# EAGLE design final (EAGLE 8.1.0)

## Sheet 1 of 2
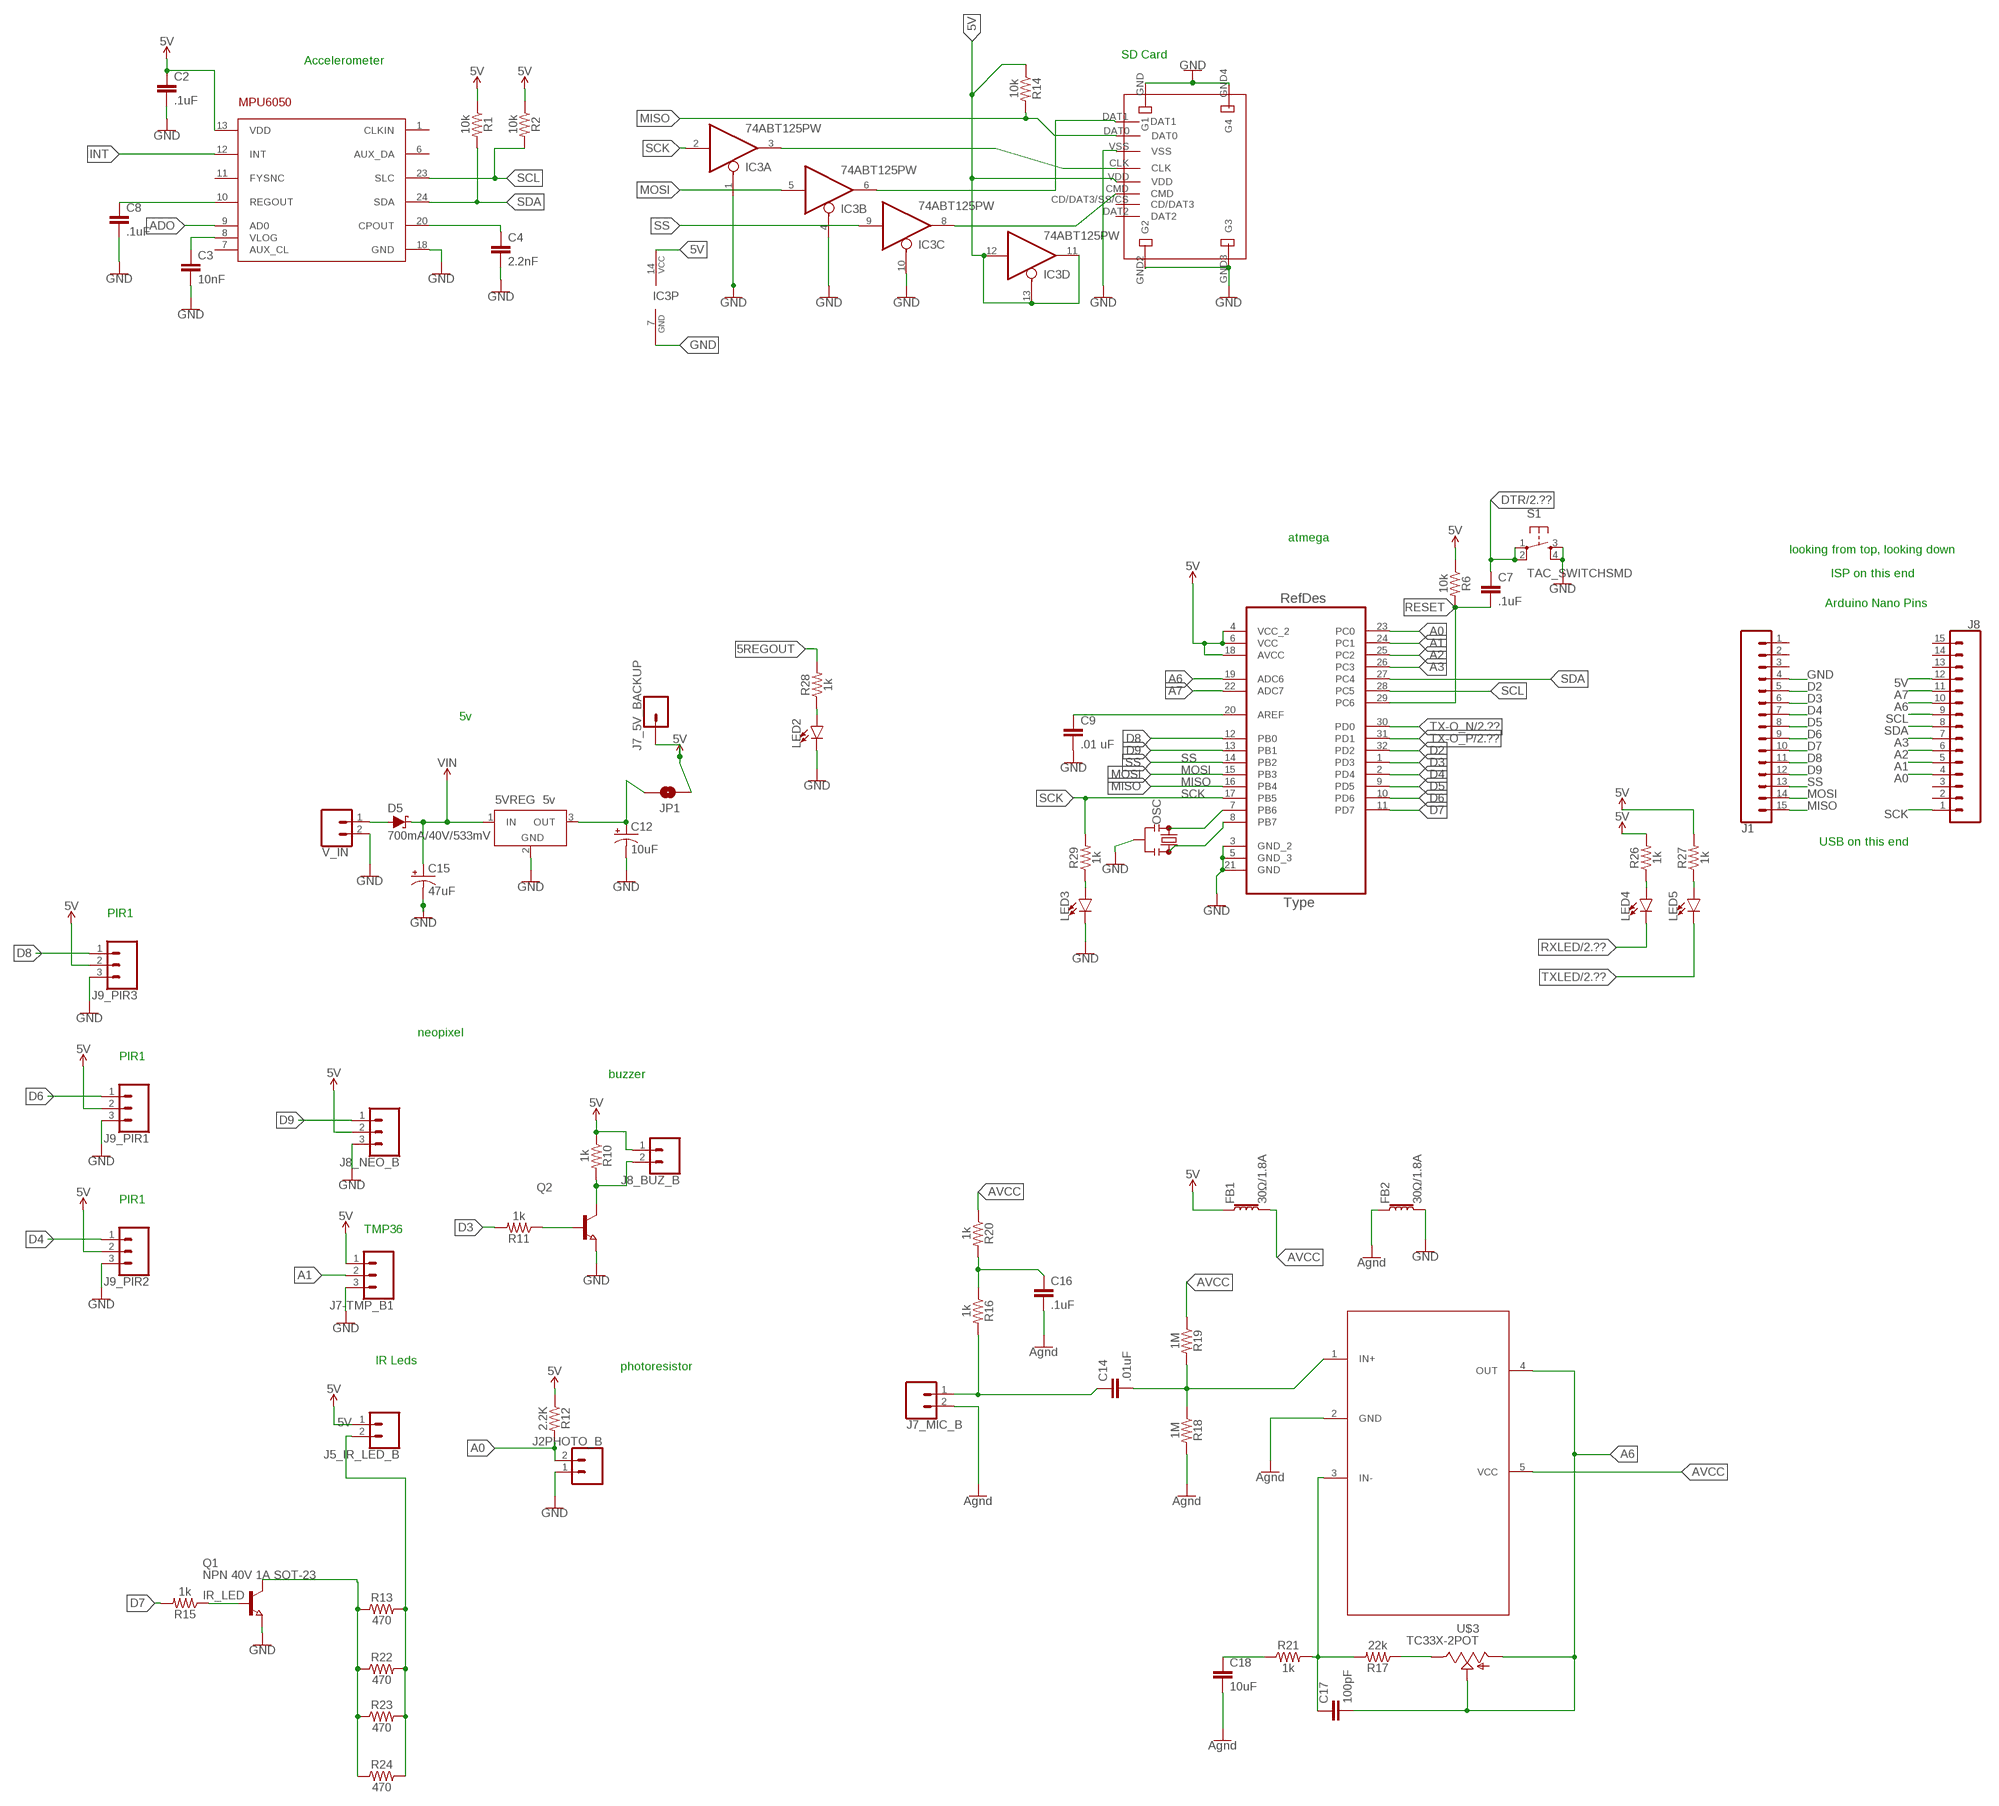
[diagram p0: schematic, sheet 1]

### Parts
5VREG  5v  LT1129CST5  [SOT223]
ATMEGA328P-AU  ATMEGA328P-AU  [QFP80P900X900X120-32N]
C2  .1uF  .22UF-CER  [0402-CAP]
C3  10nF  .22UF-CER  [0402-CAP]
C4  2.2nF  .22UF-CER  [0402-CAP]
C7  .1uF  .22UF-CER  [0402-CAP]
C8  .1uF  .22UF-CER  [0402-CAP]
C9  .01 uF  .22UF-CER  [0402-CAP]
C12  10uF  10UF-TANT  [EIA3216]
C14  .01uF  .22UF-CER  [0402-CAP]
C15  47uF  10UF-TANT  [EIA3216]
C16  .1uF  .22UF-CER  [0402-CAP]
C17  100pF  .22UF-CER  [0402-CAP]
C18  10uF  .22UF-CER  [0402-CAP]
D5  700mA/40V/533mV  DIODE-SCHOTTKY-ZLLS500  [SOT23-3]
FB1  30Ω/1.8A  FERRITE_BEAD-0603  [0603]
FB2  30Ω/1.8A  FERRITE_BEAD-0603  [0603]
IC3  74ABT125PW  [TSSOP14]
IC4  MAX4466KS  [SC70-5]
J1  CONN_15  [1X15]
J2PHOTO_B  CONN_02LOCK  [1X02_LOCK]
J5_IR_LED_B  CONN_02LOCK  [1X02_LOCK]
J7-TMP_B1  CONN_03  [1X03]
J7_5V_BACKUP  CONN_01  [1X01]
J7_MIC_B  CONN_02LOCK  [1X02_LOCK]
J8  CONN_15  [1X15]
J8_BUZ_B  CONN_02LOCK  [1X02_LOCK]
J8_NEO_B  CONN_03  [1X03]
J9_PIR1  CONN_03  [1X03]
J9_PIR2  CONN_03  [1X03]
J9_PIR3  CONN_03  [1X03]
JP1  JUMPER-SMT_2_NO_NO-SILK_ROUND  [SMT-JUMPER_2_NO_NO-SILK_ROUND]
LED2  LED0603  [LED-0603]
LED3  LED0603  [LED-0603]
LED4  LED0603  [LED-0603]
LED5  LED0603  [LED-0603]
MPU6050  MPU-6050  [QFN24-4X4]
OSC  RESONATORSMD-3.2X1.3  [RESONATOR-SMD-3.2X1.3]
Q1  NPN 40V 1A SOT-23  NPN-TRANSISTOR_SOT23  [SOT23]
Q2  NPN-TRANSISTOR_SOT23  [SOT23]
R1  10k  0.05OHM-0603-1/5W-1%  [0603]
R2  10k  0.05OHM-0603-1/5W-1%  [0603]
R6  10k  0.05OHM-0603-1/5W-1%  [0603]
R10  1k  0.05OHM-0603-1/5W-1%  [0603]
R11  1k  0.05OHM-0603-1/5W-1%  [0603]
R12  2.2K  0.05OHM-0603-1/5W-1%  [0603]
R13  470  2.2MOHM-1/10W-5%(0603)  [0603]
R14  10k  0.05OHM-0603-1/5W-1%  [0603]
R15  1k  0.05OHM-0603-1/5W-1%  [0603]
R16  1k  0.05OHM-0603-1/5W-1%  [0603]
R17  22k  0.05OHM-0603-1/5W-1%  [0603]
R18  1M  0.05OHM-0603-1/5W-1%  [0603]
R19  1M  0.05OHM-0603-1/5W-1%  [0603]
R20  1k  0.05OHM-0603-1/5W-1%  [0603]
R21  1k  0.05OHM-0603-1/5W-1%  [0603]
R22  470  2.2MOHM-1/10W-5%(0603)  [0603]
R23  470  2.2MOHM-1/10W-5%(0603)  [0603]
R24  470  2.2MOHM-1/10W-5%(0603)  [0603]
R26  1k  2.2MOHM-1/10W-5%(0603)  [0603]
R27  1k  2.2MOHM-1/10W-5%(0603)  [0603]
R28  1k  2.2MOHM-1/10W-5%(0603)  [0603]
R29  1k  2.2MOHM-1/10W-5%(0603)  [0603]
S1  TAC_SWITCHSMD  [TACTILE-SWITCH-SMD]
U$2  WM6698TR-ND_MICROSD  [MICROSD2]
U$3  TC33X-2POT  [TC33X-2]
V_IN  CONN_02LOCK  [1X02_LOCK]

### Nets
2.2NF: C4.1 MPU6050.20(CPOUT)
5REGOUT: 5VREG.3(OUT) C12.A(+) JP1.2 R28.2
5V: ATMEGA328P-AU.4(VCC_2) ATMEGA328P-AU.6(VCC) ATMEGA328P-AU.18(AVCC) C2.1 FB1.1 IC3.11(D:O) IC3.12(D:I) IC3.13(D:OE) IC3.14(P:VCC) J5_IR_LED_B.1 J7-TMP_B1.1 J7_5V_BACKUP.1 J8.12 J8_BUZ_B.1 J8_NEO_B.2 J9_PIR1.2 J9_PIR2.2 J9_PIR3.2 JP1.1 MPU6050.13(VDD) R1.1 R2.1 R6.1 R10.1 R12.1 R14.1 R26.2 R27.2 U$2.VDD ; also sheet 2
10NF: C3.1 MPU6050.8(VLOG)
.UF: C8.1 MPU6050.10(REGOUT)
A0: ATMEGA328P-AU.23(PC0) J2PHOTO_B.2 J8.4 R12.2
A1: ATMEGA328P-AU.24(PC1) J7-TMP_B1.2 J8.5
A2: ATMEGA328P-AU.25(PC2) J8.6
A3: ATMEGA328P-AU.26(PC3) J8.7
A6: ATMEGA328P-AU.19(ADC6) C17.2 IC4.4(OUT) J8.10 U$3.2 U$3.3
A7: ATMEGA328P-AU.22(ADC7) J8.11
ADO: MPU6050.9(AD0)
AVCC: FB1.2 IC4.5(VCC) R19.1 R20.1
BUZ-: J8_BUZ_B.2 Q2.3(C) R10.2
D2: ATMEGA328P-AU.32(PD2) J1.5
D3: ATMEGA328P-AU.1(PD3) J1.6 R11.2
D4: ATMEGA328P-AU.2(PD4) J1.7 J9_PIR2.1
D5: ATMEGA328P-AU.9(PD5) J1.8
D6: ATMEGA328P-AU.10(PD6) J1.9 J9_PIR1.1
D7: ATMEGA328P-AU.11(PD7) J1.10 R15.2
D8: ATMEGA328P-AU.12(PB0) J1.11 J9_PIR3.1
D9: ATMEGA328P-AU.13(PB1) J1.12 J8_NEO_B.1
DAT1: IC3.6(B:O) U$2.DAT1
DTR: C7.1 S1.1 S1.2 ; also sheet 2
GND: 5VREG.2(GND) ATMEGA328P-AU.3(GND_2) ATMEGA328P-AU.5(GND_3) ATMEGA328P-AU.21(GND) C2.2 C3.2 C4.2 C8.2 C9.2 C12.C(-) C15.C(-) C16.2 C18.2 FB2.1 FB2.2 IC3.1(A:OE) IC3.4(B:OE) IC3.7(P:GND) IC3.10(C:OE) IC4.2(GND) J1.4 J2PHOTO_B.1 J7-TMP_B1.3 J7_MIC_B.2 J8_NEO_B.3 J9_PIR1.3 J9_PIR2.3 J9_PIR3.3 LED2.C LED3.C MPU6050.18(GND) OSC.2 Q1.2(E) Q2.2(E) R18.2 S1.3 S1.4 U$2.GND2(G2) U$2.GND3(G3) U$2.GND4(G4) U$2.GND(G1) U$2.VSS V_IN.2 ; supply symbol labelled Agnd ; also sheet 2
INT: MPU6050.12(INT)
IR_LED: Q1.1(B) R15.1
LED4: LED4.A R26.1
LED5: LED5.A R27.1
MIC_IN+: C14.2 IC4.1(IN+) R18.1 R19.2
MIC_IN_C14: C14.1 J7_MIC_B.1 R16.2
MICNET1K: C16.1 R16.1 R20.2
MISO: ATMEGA328P-AU.16(PB4) J1.15 R14.2 U$2.DAT0
MOSI: ATMEGA328P-AU.15(PB3) IC3.5(B:I) J1.14
N$1: J5_IR_LED_B.2 R13.2 R22.2 R23.2 R24.2
N$2: Q1.3(C) R13.1 R22.1 R23.1 R24.1
N$4: LED3.A R29.1
N$6: ATMEGA328P-AU.20(AREF) C9.1
N$12: R17.1 U$3.1
N$20: Q2.1(B) R11.1
N$22: D5.1(A) V_IN.1
N$29: C18.1 R21.1
N$30: C17.1 IC4.3(IN-) R17.2 R21.2
PB6: ATMEGA328P-AU.7(PB6) OSC.1
PB7: ATMEGA328P-AU.8(PB7) OSC.3
POWERLED: LED2.A R28.1
RESET: ATMEGA328P-AU.29(PC6) C7.2 R6.2
RXLED: LED4.C ; also sheet 2
SCK: ATMEGA328P-AU.17(PB5) IC3.2(A:I) J8.1 R29.2
SCK_BUFF: IC3.3(A:O) U$2.CLK
SCL: ATMEGA328P-AU.28(PC5) J8.9 MPU6050.23(SLC) R2.2
SDA: ATMEGA328P-AU.27(PC4) J8.8 MPU6050.24(SDA) R1.2
SS: ATMEGA328P-AU.14(PB2) IC3.9(C:I) J1.13
SS_BUFF: IC3.8(C:O) U$2.CMD
TX-O_N: ATMEGA328P-AU.30(PD0) ; also sheet 2
TX-O_P: ATMEGA328P-AU.31(PD1) ; also sheet 2
TXLED: LED5.C ; also sheet 2
VIN: 5VREG.1(IN) C15.A(+) D5.3(C)
Unconnected: J1.1 J1.2 J1.3 J8.2 J8.3 J8.13 J8.14 J8.15 MPU6050.1(CLKIN) MPU6050.6(AUX_DA) MPU6050.7(AUX_CL) MPU6050.11(FYSNC) U$2.CD/DAT3/SS/CS(CD/DAT3) U$2.DAT2

### Notes on the sheet
- SD Card
- Accelerometer
- atmega
- looking from top, looking down
- ISP on this end
- Arduino Nano Pins
- 5v
- USB on this end
- PIR1
- neopixel
- PIR1
- buzzer
- PIR1
- TMP36
- IR Leds
- photoresistor

## Sheet 2 of 2
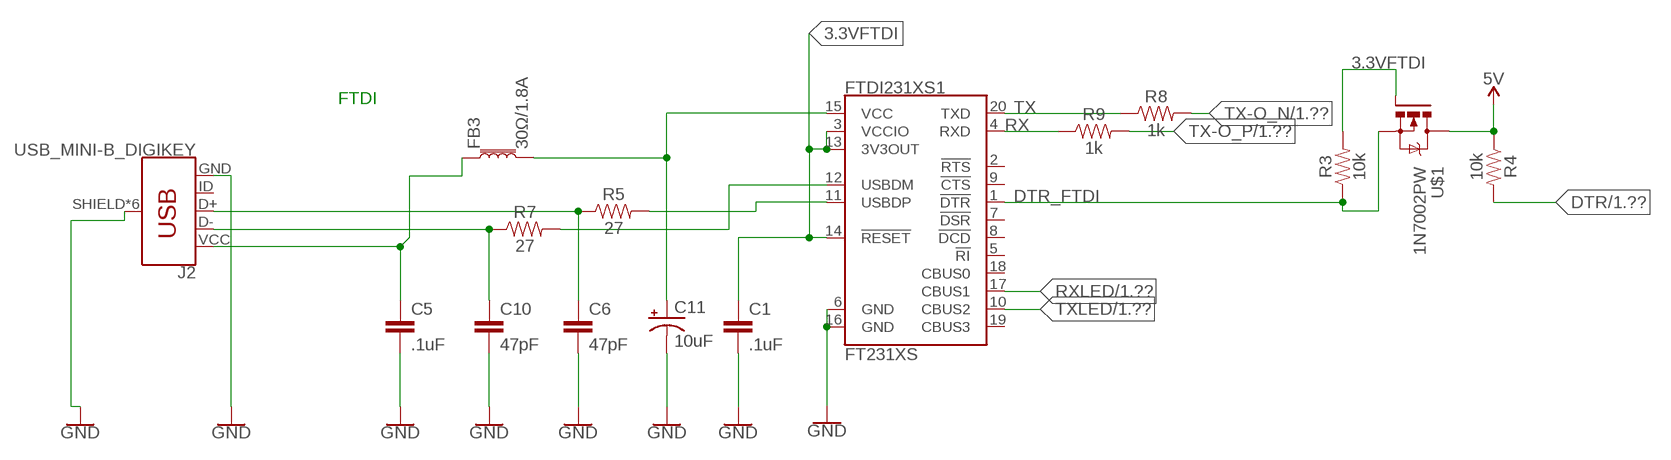
[diagram p1: schematic, sheet 2]

### Parts
C1  .1uF  .22UF-CER  [0402-CAP]
C5  .1uF  .22UF-CER  [0402-CAP]
C6  47pF  .22UF-CER  [0402-CAP]
C10  47pF  .22UF-CER  [0402-CAP]
C11  10uF  10UF-TANT  [EIA3216]
FB3  30Ω/1.8A  FERRITE_BEAD-0603  [0603]
FTDI231XS1  FT231XS  [SSOP20_L]
J2  USB_MINI-B_DIGIKEY  [MICRO-USB-DIGIKEY-FCI2]
R3  10k  0.05OHM-0603-1/5W-1%  [0603]
R4  10k  0.05OHM-0603-1/5W-1%  [0603]
R5  27  0.05OHM-0603-1/5W-1%  [0603]
R7  27  0.05OHM-0603-1/5W-1%  [0603]
R8  1k  0.05OHM-0603-1/5W-1%  [0603]
R9  1k  0.05OHM-0603-1/5W-1%  [0603]
U$1  1N7002PW  [SOT323W_INFINEON]

### Nets
3.3VFTDI: C1.1 FTDI231XS1.3(VCCIO) FTDI231XS1.13(3V3OUT) FTDI231XS1.14(!RESET) R3.2 U$1.1(G)
5V: R4.1 U$1.3(D) ; also sheet 1
DN_N: C10.1 J2.D- R7.1
DN_P: C6.1 J2.D+ R5.1
DTR: R4.2 ; also sheet 1
DTR_FTDI: FTDI231XS1.1(!DTR) R3.1 U$1.2(S)
GND: C1.2 C5.2 C6.2 C10.2 C11.C(-) FTDI231XS1.6(GND) FTDI231XS1.16(GND) J2.GND J2.SHIELD J2.SHIELD1(SHIELD) J2.SHIELD2(SHIELD) J2.SHIELD3(SHIELD) J2.SHIELD4(SHIELD) J2.SHIELD5(SHIELD) ; also sheet 1
RX: FTDI231XS1.4(RXD) R9.1
RXLED: FTDI231XS1.17(CBUS1) ; also sheet 1
TX: FTDI231XS1.20(TXD) R8.1
TX-O_N: R8.2 ; also sheet 1
TX-O_P: R9.2 ; also sheet 1
TXLED: FTDI231XS1.10(CBUS2) ; also sheet 1
USBD_N: FTDI231XS1.12(USBDM) R7.2
USBD_P: FTDI231XS1.11(USBDP) R5.2
VUSB: C5.1 C11.A(+) FB3.1 FB3.2 FTDI231XS1.15(VCC) J2.VCC(VBUS)
Unconnected: FTDI231XS1.2(!RTS) FTDI231XS1.5(!RI) FTDI231XS1.7(!DSR) FTDI231XS1.8(!DCD) FTDI231XS1.9(!CTS) FTDI231XS1.18(CBUS0) FTDI231XS1.19(CBUS3) J2.ID

### Notes on the sheet
- FTDI

## Power pins joined to a net without a drawn wire
GND: 5VREG.4(GND)

## Library data of the parts
5VREG = linear-technology:LT1129CST5: VOLTAGE REGULATOR with shutdown; MPN: LT1129CST-5#PBF; OC_FARNELL: 1663375; OC_NEWARK: 57M2069
ATMEGA328P-AU = Atmega-328pu:ATMEGA328P-AU; DESCRIPTION: 8-bit Microcontroller with In-System Programmable Flash; MPN: ATMEGA328P-AU; OC_FARNELL: 1715486; OC_NEWARK: 14R4631; PACKAGE: TQFP-32; SUPPLIER: Atmel
C1-C10 C14 C16-C18 = SparkFun-Retired:.22UF-CER: .22uF ceramic SMT CAP-09885- 50V +80%/-20% (0603); PROD_ID: CAP-09885; VALUE: .22uF
C11 C12 = SparkFun-Retired:10UF-TANT: 10uF Tantalum SMT CAP-00811- 16V 10% (EIA-3216); PROD_ID: CAP-00811
C15 = SparkFun-Retired:10UF-TANT: 10uF Tantalum SMT CAP-00811- 16V 10% (EIA-3216); PROD_ID: CAP-00811; VALUE: 10uF
D5 = SparkFun-DiscreteSemi:DIODE-SCHOTTKY: Schottky diode A Schottky diode is a semiconductor diode which has a low forward voltage drop and a very fast switching action.; PROD_ID: DIO-08411
FB1-FB3 = SparkFun-Coils:FERRITE_BEAD: Ferrite Bead (blocks, cores, rings, chokes, etc.) Inductor with layers of ferrite used to suppress high frequencies. Often used to isolate high frequency noise. SparkFun Products: IOIO-OTG - V2.2 <https://www.sparkfun.com/products/13613> SparkFun SAMD21 Mini Breakout <https://www.sparkfun.com/products/13664> SparkFun 6 Degrees of Freedom Breakout - LSM6DS3 <https://www.sparkfun.com/products/13339> SparkFun SAMD21 Dev Breakout <https://www.sparkfun.com/products/13672>; PROD_ID: NDUC-07859
FTDI231XS1 = SparkFun-IC-Comms:FT231X: FTDI FT231X Full Speed USB to Full-handshake UART This USB2.0 Full Speed IC offers a compact bridge to full handshake UART interfaces. The device is a UART, capable of operating up to 3MBaud, with low power consumption (8mA). The FT231X includes the complete FT-X series feature set and enables USB to be added into a system design quickly and easily over a UART interface. Datasheet <http://cdn.sparkfun.com/datasheets/Components/General%20IC/DS_FT231X.pdf> SparkFun Products SparkFun RedBoard - Programmed with Arduino <https://www.sparkfun.com/products/12757> (DEV-12757) SparkFun XBee Explorer USB <https://www.sparkfun.com/products/11812> (WRL-11812) SparkFun XBee Explorer Dongle <https://www.sparkfun.com/products/11697> (WRL-11697) SparkFun Blynk Board - ESP8266 <https://www.sparkfun.com/products/13794> (WRL-13794) SparkFun ESP8266 Thing - Dev Board <https://www.sparkfun.com/products/13711> (WRL-13711) SparkFun Block for Intel® Edison - Base <https://www.sparkfun.com/products/13045> (DEV-13045) SparkFun RedStick <https://www.sparkfun.com/products/13741> (DEV-13741) SparkFun Beefy 3 - FTDI Basic Breakout <https://www.sparkfun.com/products/13746> (DEV-13746) SparkFun FT231X Breakout <https://www.sparkfun.com/products/11736> (BOB-11736); PROD_ID: IC-11524
IC3 = 74xx-us:74*125: Quad bus BUFFER, 3-state
IC4 = KevinKuwata1:MAX4466: MAX4466 SOT23 SC70 mic amp arduino adafruit sparkfun
J1 J8 = SparkFun-Connectors:CONN_15: Multi connection point. Often used as Generic Header-pin footprint for 0.1 inch spaced/style header connections On any of the 0.1 inch spaced packages, you can populate with these: Break Away Headers - Straight <https://www.sparkfun.com/products/116> (PRT-00116) Break Away Male Headers - Right Angle <https://www.sparkfun.com/products/553> (PRT-00553) Female Headers <https://www.sparkfun.com/products/115> (PRT-00115) Break Away Headers - Machine Pin <https://www.sparkfun.com/products/117> (PRT-00117) Break Away Female Headers - Swiss Machine Pin <https://www.sparkfun.com/products/743> (PRT-00743) For SCREWTERMINALS and SPRING TERMINALS visit here: Screw Terimnals on SparkFun.com <https://www.sparkfun.com/search/results?term=Screw+Terminals> (5mm/3.5mm/2.54mm spacing) This device is also useful as a general connection point to wire up your design to another part of your project. Our various solder wires solder well into these plated through hole pads. Hook-Up Wire - Assortment (Stranded, 22 AWG) <https://www.sparkfun.com/products/11375> (PRT-11375) Hook-Up Wire - Assortment (Solid Core, 22 AWG) <https://www.sparkfun.com/products/11367> (PRT-11367) View the entire wire category on our website here <https://www.sparkfun.com/categories/141> Special notes: Molex polarized connector foot print use with SKU : PRT-08231 with associated crimp pins and housings. 1MM SMD Version SKU: PRT-10208 NOTES ON THE VARIANTS LOCK and LOCK_LONGPADS... This footprint was designed to help hold the alignment of a through-hole component (i.e. 6-pin header) while soldering it into place. You may notice that each hole has been shifted either up or down by 0.005 of an inch from it's more standard position (which is a perfectly straight line). This slight alteration caused the pins (the squares in the middle) to touch the edges of the holes. Because they are alternating, it causes a "brace" to hold the component in place. 0.005 has proven to be the perfect amount of "off-center" position when using our standard breakaway headers. Although looks a little odd when you look at the bare footprint, once you have a header in there, the alteration is very hard to notice. Also,if you push a header all the way into place, it is covered up entirely on the bottom side.
J2 = KevinKuwata1:USB_MINI-B_DIGIKEY: USB type Mini-B Connector Breaks out 5th pin, and includes shield pins if needed. SparkFun Products: SparkFun FTDI Basic Breakout <https://www.sparkfun.com/products/9716> SparkFun XBee Explorer USB <https://www.sparkfun.com/products/11812> SparkFun Redboard <https://www.sparkfun.com/products/12757>
J2PHOTO_B J5_IR_LED_B J7_MIC_B J8_BUZ_B V_IN = SparkFun-Connectors:CONN_02: Multi connection point. Often used as Generic Header-pin footprint for 0.1 inch spaced/style header connections On any of the 0.1 inch spaced packages, you can populate with these: Break Away Headers - Straight <https://www.sparkfun.com/products/116> (PRT-00116) Break Away Male Headers - Right Angle <https://www.sparkfun.com/products/553> (PRT-00553) Female Headers <https://www.sparkfun.com/products/115> (PRT-00115) Break Away Headers - Machine Pin <https://www.sparkfun.com/products/117> (PRT-00117) Break Away Female Headers - Swiss Machine Pin <https://www.sparkfun.com/products/743> (PRT-00743) For SCREWTERMINALS and SPRING TERMINALS visit here: Screw Terimnals on SparkFun.com <https://www.sparkfun.com/search/results?term=Screw+Terminals> (5mm/3.5mm/2.54mm spacing) This device is also useful as a general connection point to wire up your design to another part of your project. Our various solder wires solder well into these plated through hole pads. Hook-Up Wire - Assortment (Stranded, 22 AWG) <https://www.sparkfun.com/products/11375> (PRT-11375) Hook-Up Wire - Assortment (Solid Core, 22 AWG) <https://www.sparkfun.com/products/11367> (PRT-11367) View the entire wire category on our website here <https://www.sparkfun.com/categories/141> Special notes: Molex polarized connector foot print use with: PRT-08233 with associated crimp pins and housings. 2.54_SCREWTERM for use with PRT-10571. 3.5mm Screw Terminal footprints for PRT-08084 5mm Screw Terminal footprints for use with PRT-08432
J7-TMP_B1 J8_NEO_B J9_PIR1-J9_PIR3 = SparkFun-Connectors:CONN_03: Multi connection point. Often used as Generic Header-pin footprint for 0.1 inch spaced/style header connections On any of the 0.1 inch spaced packages, you can populate with these: Break Away Headers - Straight <https://www.sparkfun.com/products/116> (PRT-00116) Break Away Male Headers - Right Angle <https://www.sparkfun.com/products/553> (PRT-00553) Female Headers <https://www.sparkfun.com/products/115> (PRT-00115) Break Away Headers - Machine Pin <https://www.sparkfun.com/products/117> (PRT-00117) Break Away Female Headers - Swiss Machine Pin <https://www.sparkfun.com/products/743> (PRT-00743) Stackable Header - 3 Pin (Female, 0.1") <https://www.sparkfun.com/products/13875> (PRT-13875) For SCREWTERMINALS and SPRING TERMINALS visit here: Screw Terimnals on SparkFun.com <https://www.sparkfun.com/search/results?term=Screw+Terminals> (5mm/3.5mm/2.54mm spacing) This device is also useful as a general connection point to wire up your design to another part of your project. Our various solder wires solder well into these plated through hole pads. Hook-Up Wire - Assortment (Stranded, 22 AWG) <https://www.sparkfun.com/products/11375> (PRT-11375) Hook-Up Wire - Assortment (Solid Core, 22 AWG) <https://www.sparkfun.com/products/11367> (PRT-11367) View the entire wire category on our website here <https://www.sparkfun.com/categories/141> Special notes: Molex polarized connector foot print use with SKU : PRT-08232 with associated crimp pins and housings.
J7_5V_BACKUP = SparkFun-Connectors:CONN_01: Single connection point. Often used as Generic Header-pin footprint for 0.1 inch spaced/style header connections On any of the 0.1 inch spaced packages, you can populate with these: Break Away Headers - Straight <https://www.sparkfun.com/products/116> (PRT-00116) Break Away Male Headers - Right Angle <https://www.sparkfun.com/products/553> (PRT-00553) Female Headers <https://www.sparkfun.com/products/115> (PRT-00115) Break Away Headers - Machine Pin <https://www.sparkfun.com/products/117> (PRT-00117) Break Away Female Headers - Swiss Machine Pin <https://www.sparkfun.com/products/743> (PRT-00743) This device is also useful as a general connection point to wire up your design to another part of your project. Our various solder wires solder well into these plated through hole pads. Hook-Up Wire - Assortment (Stranded, 22 AWG) <https://www.sparkfun.com/products/11375> (PRT-11375) Hook-Up Wire - Assortment (Solid Core, 22 AWG) <https://www.sparkfun.com/products/11367> (PRT-11367) View the entire wire category on our website here <https://www.sparkfun.com/categories/141> Special notes: SMTSO-256-ET is a "flush mount" nut for a 4-40 screw. We mostly use this on specialty testbeds; it is a nice way to connect hardware to your PCB at an adjustable hieght. Also note, the SNAP packages are for using a snappable style connector. We sell a baggie of snaps and they are also used on two LilyPad designs: Snap Assortment - 30 pack (male and female) <https://www.sparkfun.com/products/11347> (DEV-11347) LilyPad Arduino SimpleSnap <https://www.sparkfun.com/products/10941> (DEV-10941) LilyPad SimpleSnap Protoboard <https://www.sparkfun.com/products/10940> (DEV-10940)
JP1 = SparkFun-Jumpers:JUMPER-SMT_2_NO: Normally open jumper This jumper has two pads in close proximity to each other. Apply solder to close the connection. Round pads are easier to solder for beginners, but are a lot larger. SparkFun Product that uses the round pads: SparkFun EL Sequencer <https://www.sparkfun.com/products/12781>
LED2-LED5 = SparkFun-LED:LED: LED (Generic) Standard schematic elements and footprints for 5mm, 3mm, 1206, and 0603 sized LEDs. Generic LEDs with no color specified.
MPU6050 = KevinKuwata1:MPU-6050
OSC = SparkFun-Clocks:RESONATOR: Resonators (Generic) Ceramic resonators are clock-generating components, often used to control timing in microcontrollers. They usually have 3 pins: two pins for oscillation, and one pin for ground. Compared to crystals, resonators have worse tolerance, but are usually much cheaper. Plus, they have built-in load capacitors! These devices are used on boards like the Arduino Pro 8MHz <https://www.sparkfun.com/products/11114> and Arduino Pro 16MHz <https://www.sparkfun.com/products/11113>.
Q1 Q2 = semicon-smd-ipc:NPN-TRANSISTOR_: NPN TRANSISTOR
R1-R12 R14-R21 = SparkFun-Resistors:0.05OHM: 0.05Ω resistor A resistor is a passive two-terminal electrical component that implements electrical resistance as a circuit element. Resistors act to reduce current flow, and, at the same time, act to lower voltage levels within circuits. - Wikipedia; PROD_ID: RES-12535; VALUE: 0.05
R13 R22-R24 R26-R29 = SparkFun-Retired:2.2MOHM-1/10W-5%(0603): RES-09288; PROD_ID: RES-09288
S1 = SparkFun-Retired:TAC_SWITCH: Momentary Switch Button commonly used for reset or general input. Spark Fun Electronics SKU : COM-00097 SMT- SWCH-08247; PROD_ID: SWCH-08247
U$1 = KevinKuwata1:1N7002PW
U$2 = KevinKuwata1:WM6698TR-ND_MICROSD
U$3 = KevinKuwata1:TC33X-2POT

## Net classes
0 default: clearance 0.051 mm

## Board
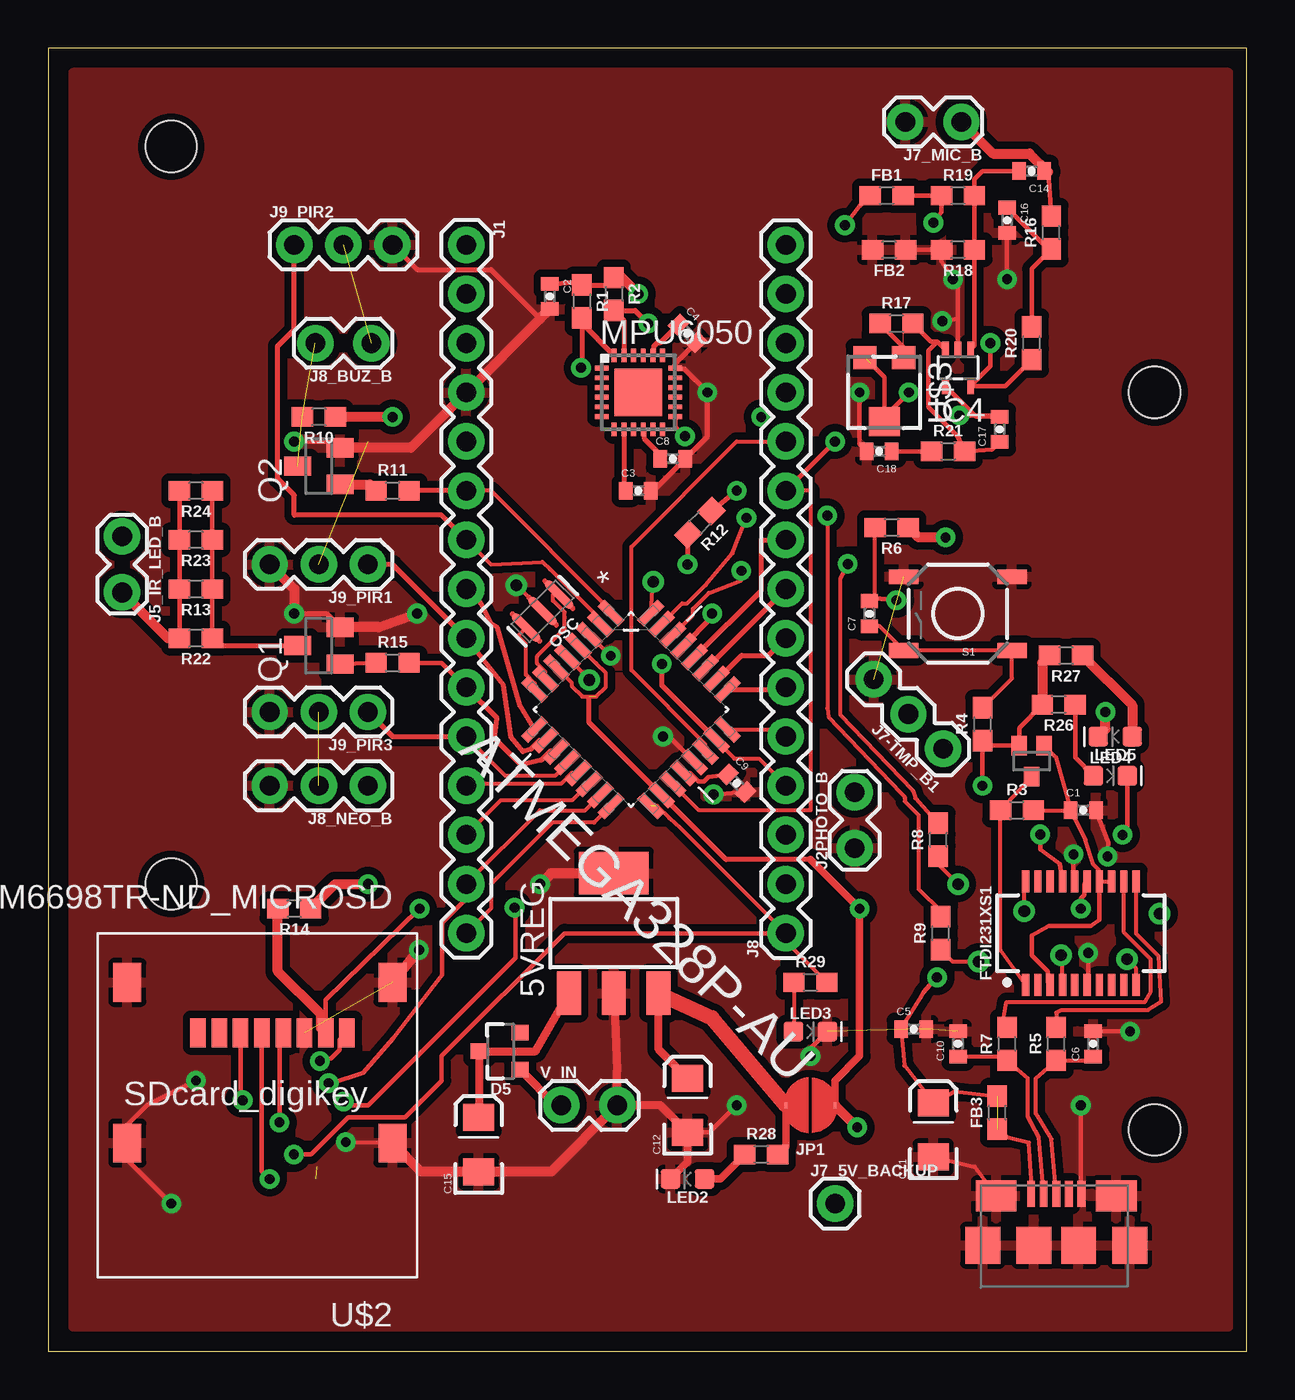
[diagram p2: board, top side]
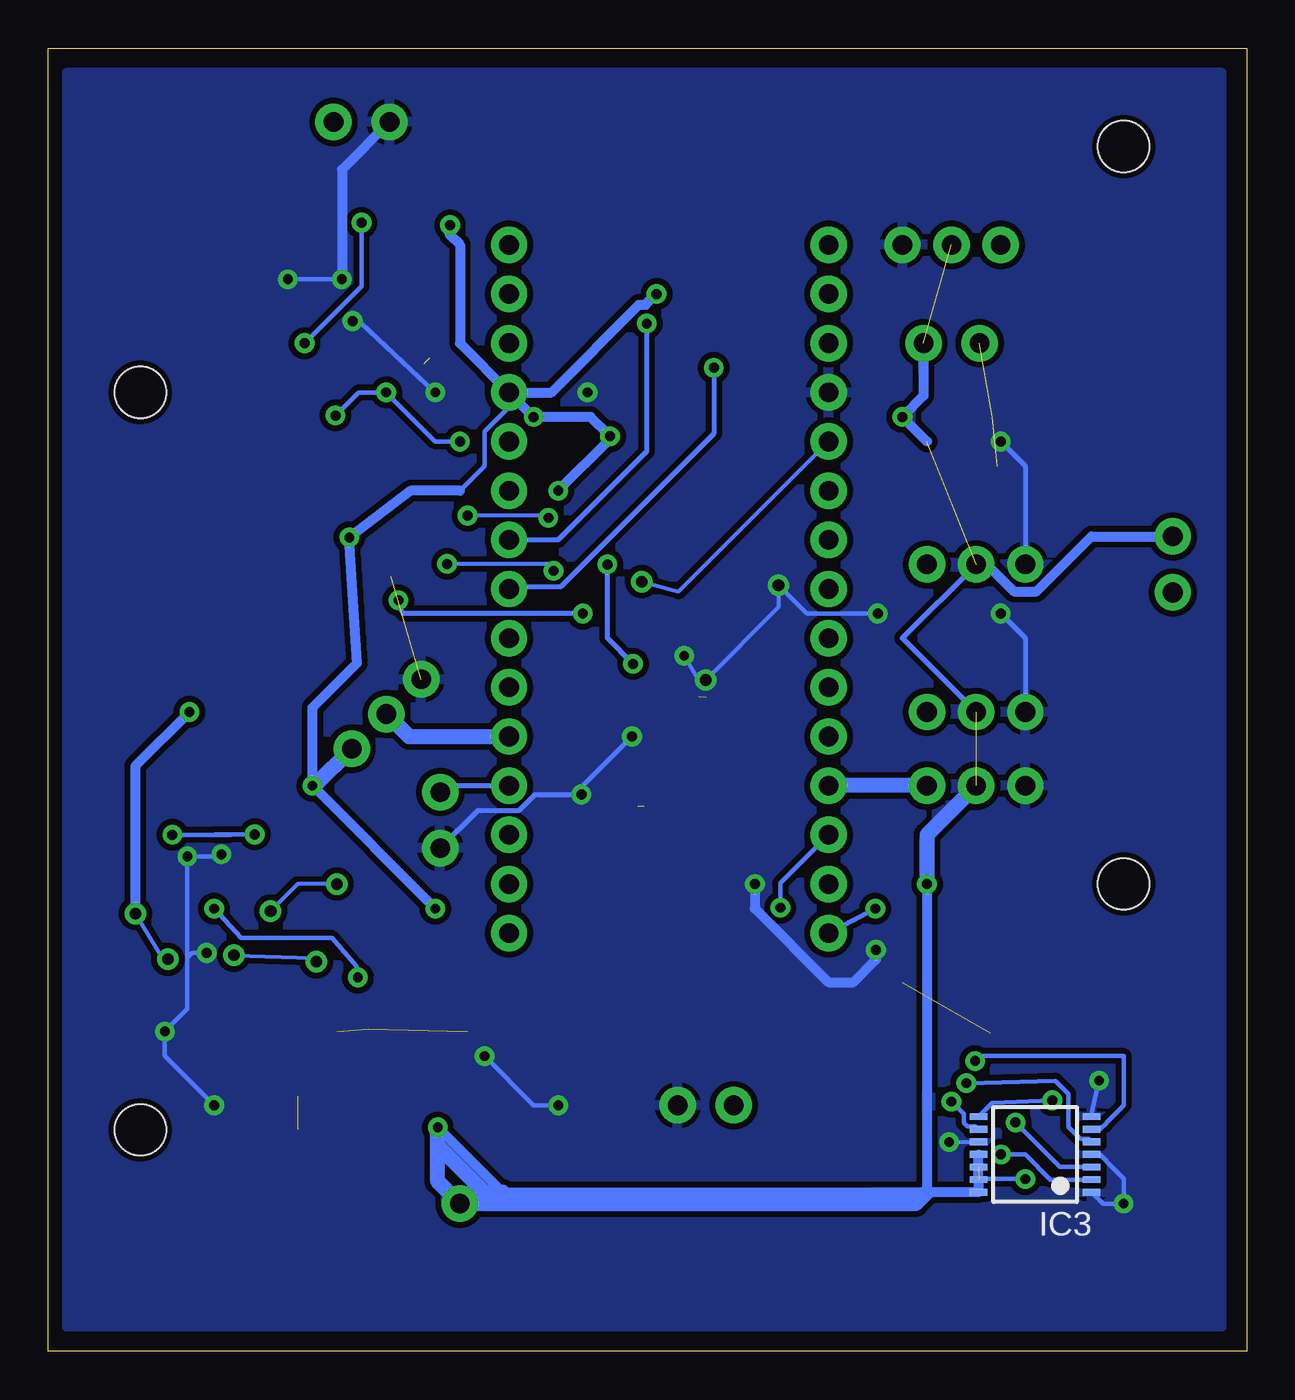
[diagram p3: board, bottom side, seen from below]

Size 61.9 x 67.3 mm. Coordinates in mm from the lower left corner, seen from the top.
Outline: 0,0 61.9,0 61.9,67.3 0,67.3 0,0
Copper layers (1*16): Top 0.035mm / dielectric 1.5mm / Bottom 0.035mm
Design rules "SparkFun": minimum track width 8mil, minimum drill 20mil, track to track 8mil, track to pad 8mil, pad to pad 8mil, via to via 8mil, smd to smd 8mil, copper to edge 10mil, drill to drill 8mil, minimum pad ring 12mil, minimum via ring 10mil, stop-mask expansion 4mil, vias tented up to drill 25mil, thermal gap 10mil
Holes 2.65 mm at 6.35,62.23 57.15,49.53 57.15,11.43 6.35,24.13

### Footprints (pad centres in the part's own frame; a part is rotated, then mirrored left to right if it is on the bottom)
SOT223 = smd 1.219 x 2.235: 1 -2.311,-3.099; 2 0,-3.099; 3 2.311,-3.099 | smd 3.6 x 2.2: 4 0,3.099
QFP80P900X900X120-32N = smd 1.473 x 0.508: 1 -4.242,2.794; 2 -4.242,2.007; 3 -4.242,1.194; 4 -4.242,0.406; 5 -4.242,-0.406; 6 -4.242,-1.194; 7 -4.242,-2.007; 8 -4.242,-2.794; 17 4.242,-2.794; 18 4.242,-2.007; 19 4.242,-1.194; 20 4.242,-0.406; 21 4.242,0.406; 22 4.242,1.194; 23 4.242,2.007; 24 4.242,2.794 | smd 0.508 x 1.473: 9 -2.794,-4.242; 10 -2.007,-4.242; 11 -1.194,-4.242; 12 -0.406,-4.242; 13 0.406,-4.242; 14 1.194,-4.242; 15 2.007,-4.242; 16 2.794,-4.242; 25 2.794,4.242; 26 2.007,4.242; 27 1.194,4.242; 28 0.406,4.242; 29 -0.406,4.242; 30 -1.194,4.242; 31 -2.007,4.242; 32 -2.794,4.242
0402-CAP = smd 0.7 x 0.9: 1 -0.65,0; 2 0.65,0
EIA3216 = smd 1.4 x 1.6: A 1.4,0; C -1.4,0
SOT23-3 = smd 0.8 x 0.9: 1 -0.95,-1; 2 0.95,-1; 3 0,1.1
0603 = smd 1.1 x 1: 1 -0.85,0; 2 0.85,0
SSOP20_L = smd 0.381 x 1.143: 1 -2.857,-2.68; 2 -2.223,-2.68; 3 -1.587,-2.68; 4 -0.953,-2.68; 5 -0.318,-2.68; 6 0.318,-2.68; 7 0.953,-2.68; 8 1.587,-2.68; 9 2.223,-2.68; 10 2.857,-2.68; 11 2.857,2.68; 12 2.223,2.68; 13 1.587,2.68; 14 0.953,2.68; 15 0.318,2.68; 16 -0.318,2.68; 17 -0.953,2.68; 18 -1.587,2.68; 19 -2.223,2.68; 20 -2.857,2.68
TSSOP14 = smd 0.35 x 0.9: 1 -1.95,-2.925; 2 -1.3,-2.925; 3 -0.65,-2.925; 4 0,-2.925; 5 0.65,-2.925; 6 1.3,-2.925; 7 1.95,-2.925; 8 1.95,2.925; 9 1.3,2.925; 10 0.65,2.925; 11 0,2.925; 12 -0.65,2.925; 13 -1.3,2.925; 14 -1.95,2.925
SC70-5 = smd 0.35 x 0.8: 1 -0.65,-0.95; 2 0,-0.95; 3 0.65,-0.95; 4 0.65,0.95; 5 -0.65,0.95
1X15 = drill 1.016 pad 1.88: 1 0,0; 2 2.54,0; 3 5.08,0; 4 7.62,0; 5 10.16,0; 6 12.7,0; 7 15.24,0; 8 17.78,0; 9 20.32,0; 10 22.86,0; 11 25.4,0; 12 27.94,0; 13 30.48,0; 14 33.02,0; 15 35.56,0
MICRO-USB-DIGIKEY-FCI2 = smd 0.4 x 1.35: D+ 0,2.67; D- -0.65,2.67; GND 1.3,2.67; ID 0.65,2.67; VCC -1.3,2.67 | smd 2.1 x 1.6: SHIELD -3.1,2.55; SHIELD1 3.1,2.55 | smd 1.8 x 1.9: SHIELD2 -3.8,0; SHIELD3 -1.15,0; SHIELD4 1.15,0; SHIELD5 3.8,0
1X02_LOCK = drill 1.016 pad 1.88: 1 -0.178,0; 2 2.718,0
1X03 = drill 1.016 pad 1.88: 1 0,0; 2 2.54,0; 3 5.08,0
1X01 = drill 1.016 pad 1.88: 1 0,0
SMT-JUMPER_2_NO_NO-SILK_ROUND = smd 0.152 x 0.305: 1 -1.27,0; 2 1.27,0
LED-0603 = smd 1 x 1: A -0.877,0; C 0.877,0
QFN24-4X4 = smd 0.7 x 0.25: 1 -1.9,1.25; 2 -1.9,0.75; 3 -1.9,0.25; 4 -1.9,-0.25; 5 -1.9,-0.75; 6 -1.9,-1.25; 13 1.9,-1.25; 14 1.9,-0.75; 15 1.9,-0.25; 16 1.9,0.25; 17 1.9,0.75; 18 1.9,1.25 | smd 0.25 x 0.7: 7 -1.25,-1.9; 8 -0.75,-1.9; 9 -0.25,-1.9; 10 0.25,-1.9; 11 0.75,-1.9; 12 1.25,-1.9; 19 1.25,1.9; 20 0.75,1.9; 21 0.25,1.9; 22 -0.25,1.9; 23 -0.75,1.9; 24 -1.25,1.9 | smd 2.45 x 2.45: EXP 0,0
RESONATOR-SMD-3.2X1.3 = smd 0.45 x 1.905: 1 -1.2,0; 2 0,0; 3 1.2,0
SOT23 = smd 1 x 1.4: 1 -0.95,-1.1; 2 0.95,-1.1; 3 0,1.1
TACTILE-SWITCH-SMD = smd 1.524 x 0.762: 1 -2.794,1.905; 2 2.794,1.905; 3 -2.794,-1.905; 4 2.794,-1.905
SOT323W_INFINEON = smd 1 x 0.8: 1 -0.8,0.65; 2 0.8,0; 3 -0.8,-0.65
MICROSD2 = smd 0.8 x 1.5: CD/DAT3/SS/CS 8.95,2.6; CLK 5.65,2.6; CMD 7.85,2.6; DAT0 3.45,2.6; DAT1 2.35,2.6; DAT2 10.05,2.6; VDD 6.75,2.6; VSS 4.55,2.6 | smd 1.45 x 2: GND 0,8.3; GND2 13.7,8.3; GND3 13.7,0; GND4 0,0
TC33X-2 = smd 1.2 x 1.2: 1 -1.8,1; 3 -1.8,-1 | smd 1.5 x 1.6: 2 1.5,0

### Placement (x,y rotation side)
5VREG  29.21,21.59 0 top
ATMEGA328P-AU  30.1,33.15 315 top
C1  53.47,27.94 0 top
C2  25.91,54.48 270 top
C3  30.48,44.45 0 top
C4  33.02,52.58 315 top
C5  44.7,16.64 0 top
C6  53.98,15.88 90 top
C7  42.42,38.1 90 top
C8  32.26,46.1 0 top
C9  35.56,29.34 315 top
C10  46.99,15.88 90 top
C11  45.72,11.43 90 top
C12  33.02,12.7 90 top
C14  50.8,60.96 180 top
C15  22.22,10.67 90 top
C16  49.53,58.42 270 top
C17  49.15,47.62 90 top
C18  42.93,46.48 180 top
D5  23.37,15.49 90 top
FB1  43.31,59.69 0 top
FB2  43.43,56.9 180 top
FB3  49.02,12.32 90 top
FTDI231XS1  53.34,21.59 0 top
IC3  10.92,10.16 90 bottom
IC4  46.99,50.8 180 top
J1  21.59,57.15 270 top
J2  52.07,5.46 0 top
J2PHOTO_B  41.66,26.16 90 top
J5_IR_LED_B  3.81,41.91 270 top
J7-TMP_B1  46.23,31.11 135 top
J7_5V_BACKUP  40.64,7.62 0 top
J7_MIC_B  46.99,63.5 180 top
J8  38.1,21.59 90 top
J8_BUZ_B  16.51,52.07 180 top
J8_NEO_B  16.51,29.21 180 top
J9_PIR1  16.51,40.64 180 top
J9_PIR2  12.7,57.15 0 top
J9_PIR3  16.51,33.02 180 top
JP1  39.37,12.7 180 top
LED2  33.02,8.89 180 top
LED3  39.37,16.51 0 top
LED4  54.86,29.72 0 top
LED5  55.12,31.75 180 top
MPU6050  30.48,49.53 0 top
OSC  25.53,38.23 225 top
Q1  13.97,36.45 90 top
Q2  13.97,45.72 90 top
R1  27.56,54.23 270 top
R2  29.21,54.61 270 top
R3  50.04,27.94 0 top
R4  48.26,32.38 90 top
R5  52.07,15.88 90 top
R6  43.56,42.54 180 top
R7  49.53,15.88 90 top
R8  45.97,26.42 90 top
R9  46.1,21.59 90 top
R10  13.97,48.26 180 top
R11  17.78,44.45 0 top
R12  33.66,42.8 225 top
R13  7.62,39.37 180 top
R14  12.7,22.86 180 top
R15  17.78,35.56 0 top
R16  51.82,57.78 90 top
R17  43.81,53.09 0 top
R18  46.99,56.9 180 top
R19  46.99,59.69 0 top
R20  50.8,52.07 90 top
R21  46.48,46.48 0 top
R22  7.62,36.83 180 top
R23  7.62,41.91 180 top
R24  7.62,44.45 180 top
R26  52.2,33.4 180 top
R27  52.58,35.94 180 top
R28  36.83,10.16 0 top
R29  39.37,19.05 0 top
S1  46.99,38.1 180 top
U$1  50.8,30.48 270 top
U$2  17.78,19.05 180 top
U$3  43.18,49.53 270 top
V_IN  26.67,12.7 0 top

### Tracks (layer width: path | path; a pad name or v marks a point on that pad's centre or on a via)
2.2NF
  Top 0.254: MPU6050.20 31.28,51.47 31.28,51.92 31.47,52.11 31.63,52.11 C4.1
3.3VFTDI
  Top 0.203: FTDI231XS1.13 FTDI231XS1.14 54.29,24.83 53.97,25.15 53.58,26.42 C1.1 | R3.2 C1.1 | U$1.1 52.06,30.68 C1.1
  Top 0.229: 51.62,19.5 51.75,19.37 FTDI231XS1.3 51.62,19.04 51.62,19.61 50.8,20.44 50.8,21.46 51.69,21.97 53.85,21.97 54.29,22.29 FTDI231XS1.14
5REGOUT
  Top 0.381: JP1.2 38.1,10.58 R28.2
  Top 0.406: C12.A 31.52,15.6 5VREG.3
  Top 0.762: JP1.2 34.29,17.22 5VREG.3
5V  (via drill 0.51)  (5 unrouted)
  Top 0.203: ATMEGA328P-AU.4 28.29,35.53 28.3,35.53 28.8,35.03 28.8,34.31 28.3,33.81 27.58,33.81 27.03,34.37 27.03,34.53 ATMEGA328P-AU.6
  Top 0.229: v48.26,29.21 R4.1 48.52,31.28 U$1.3 50.15,32.2 R26.2 | 44.45,42.54 R6.1 | U$2.VDD 11.03,9.29 v11.43,8.89 | v41.15,58.17 41.91,59.14 FB1.1
  Top 0.254: 39.37,25.4 35.01,25.4 ATMEGA328P-AU.18 27.94,32.47 27.94,33.79 | R2.1 28.83,55.08 R1.1 27.38,55.26 C2.1 | MPU6050.13 32.38,47.77 v32.88,47.26 | R12.1 v35.56,44.45
  Top 0.381: JP1.1 40.64,13.97 41.91,15.24 v41.91,22.86 39.37,25.4
  Top 0.508: R2.1 29.63,55.46 v30.48,54.61 | v41.78,11.56 JP1.1 | v17.78,48.26 R10.1 | v46.36,42.04 44.96,42.04 44.45,42.54 | R14.1 14.82,24.13 v16.51,24.13 | R27.2 51.35,35.56 R26.2
  Bottom 0.229: v11.43,8.89 13.82,8.89 IC3.13 | J8.12 38.1,48.77 39.36,47.51 39.36,45.73 40.64,44.45
  Bottom 0.254: J9_PIR3.2 17.78,36.83 J9_PIR1.2
  Bottom 0.508: J8.12 v36.83,48.26 33.88,48.26 v32.88,47.26 32.88,47.13 v35.56,44.45 | v30.48,54.61 31.04,54.05 31.39,54.05 35.91,49.53 J8.12 | IC3.11 IC3.13 IC3.14 16.51,8.21 | 16.51,8.21 38.44,8.21 v41.78,11.56 | v16.51,24.13 16.51,8.21 | 16.51,46.99 v17.78,48.26 16.69,49.35 J8_BUZ_B.1 | 40.64,44.45 43.18,44.45 v46.36,42.04 45.95,35.55 48.26,33.24 v48.26,29.21 v41.91,22.86 | J8.12 40.64,52.07 40.64,57.15 41.15,57.66 v41.15,58.17 | J5_IR_LED_B.1 8.01,42.09 10.85,39.24 12.01,39.24 13.41,40.64 J9_PIR1.2
  Bottom 0.762: J7_5V_BACKUP.1 40.05,8.21 39.37,8.21 | 39.37,8.21 38.44,8.21 | 16.51,8.21 17.1,7.62 J7_5V_BACKUP.1 | 39.37,8.21 41.78,10.62 v41.78,11.56 41.78,8.76 J7_5V_BACKUP.1 | J8_NEO_B.2 16.51,26.67 v16.51,24.13 | J7-TMP_B1.1 48.13,29.21 v48.26,29.21
  pour Bottom (isolate 0.305, rank 2): 15.24,57.15 19.05,57.15 19.05,7.62 44.45,7.62 44.45,3.81 15.24,3.81
10NF
  Top 0.254: MPU6050.8 29.73,44.45 C3.1
.UF
  Top 0.254: MPU6050.10 30.78,47.58 30.78,47.14 31.61,46.31 C8.1
A0  (via drill 0.51)
  Top 0.203: ATMEGA328P-AU.23 34.52,31.52 35.43,30.61 36.7,30.61 J8.4
  Top 0.254: ATMEGA328P-AU.23 31.69,34.39 v31.69,35.5 | v33.02,40.64 arc90 33.05,40.67 R12.2
  Bottom 0.254: J2PHOTO_B.2 41.33,29.21 J8.4 | v31.69,35.5 33.02,36.83 v33.02,40.64
A1
  Top 0.203: ATMEGA328P-AU.24 37.73,32.12 J8.5
  Bottom 0.762: J7-TMP_B1.2 43.27,31.75 J8.5
A2
  Top 0.254: ATMEGA328P-AU.25 37.98,34.17 J8.6
A3
  Top 0.254: ATMEGA328P-AU.26 34.6,34.73 35.81,35.94 37.21,35.94 J8.7
A6  (via drill 0.51)  (1 unrouted)
  Top 0.203: J8.10 39.37,44.45 39.37,27.94 33.62,27.94 ATMEGA328P-AU.19
  Top 0.229: 42.5,51.01 43.18,50.33 U$3.2 43.18,48.26 v44.45,49.53 | IC4.4 47.92,48.27 C17.2 49.09,48.34 v47.07,48.34 | J8.10 v40.64,46.99
  Bottom 0.229: v47.07,48.34 45.87,49.53 v44.45,49.53 41.91,46.99 v40.64,46.99
A7
  Top 0.203: ATMEGA328P-AU.22 33.94,31.35 30.12,35.18 30.12,41.55 35.56,46.99 J8.11
AVCC  (via drill 0.51)
  Top 0.229: FB1.2 R19.1 46.14,58.84 v45.72,58.29 | R20.1 49.43,49.85 IC4.5 48.67,50.88 v48.67,52.07
  Bottom 0.229: v48.67,52.07 45.72,55.01 v45.72,58.29
BUZ-  (2 unrouted)
D2  (via drill 0.6)
  Top 0.203: ATMEGA328P-AU.32 31.14,38.12 v31.24,39.75
  Bottom 0.203: v31.24,39.75 29.34,39.24 J1.5
D3
  Top 0.203: ATMEGA328P-AU.1 29.07,38.23 22.86,44.45 J1.6
  Top 0.254: J1.6 R11.2
D4
  Top 0.203: ATMEGA328P-AU.2 28.5,37.59 28.5,37.81 25.91,40.4 25.53,40.77 22.86,40.64 J1.7
  Top 0.254: J1.7 20.32,43.18 12.7,43.18 12.7,44.22 11.84,45.08 11.84,51.91 12.7,52.77 J9_PIR2.1
D5
  Top 0.254: ATMEGA328P-AU.9 24.36,33.34 23.84,35.14 23.2,37.38 22.86,37.59 22.35,38.61 J1.8
D6
  Top 0.254: ATMEGA328P-AU.10 25.39,31.57 24.92,31.09 24.52,30.97 23.89,31.72 23.51,34.4 J1.9 17.78,40.64 J9_PIR1.1
D7
  Top 0.229: R15.2 20.32,35.56 J1.10
  Top 0.254: ATMEGA328P-AU.11 25.93,30.99 25.48,30.54 24.43,30.28 23.05,31.66 23.18,32.7 J1.10
D8
  Top 0.203: ATMEGA328P-AU.12 26.81,30.37 26.16,29.72 23.62,29.72 J1.11
  Top 0.254: J9_PIR3.1 17.78,31.75 J1.11
D9
  Top 0.203: ATMEGA328P-AU.13 27.03,29.86 26.48,29.31 21.69,29.31 J1.12
  Bottom 0.762: J8_NEO_B.1 J1.12
DAT1  (via drill 0.51)
  Top 0.229: U$2.DAT1 15.05,16.07 15.05,15.57 14.6,15.12 v14.03,14.99
  Bottom 0.229: IC3.6 7.57,11.46 7.23,11.8 7.23,11.82 6.35,12.7 6.35,15.24 13.97,15.24 13.97,15.06 v14.03,14.99
DN_N
  Top 0.203: J2.D- 51.17,11.03 50.6,12.11 50.6,14.09 R7.1 49.33,15.23 C10.1
DN_P
  Top 0.203: J2.D+ 51.82,10.96 51,12.28 51,14.09 R5.1 53.78,15.03 C6.1
DTR
  Top 0.203: R4.2 49.78,34.76 S1.1 S1.2 42.94,37.45 C7.1
DTR_FTDI
  Top 0.203: FTDI231XS1.1 49.19,20.71 R3.1 U$1.2
GND  (via drill 0.51, 0.6)  (4 unrouted)
  Top 0.203: C11.C 47.84,9.52 J2.SHIELD | v24.18,39.57 OSC.2 | v27.94,34.67 27.94,34.73 ATMEGA328P-AU.5 | ATMEGA328P-AU.3 29.01,35.92 v29.05,35.92
  Top 0.229: C12.C 34.16,11.3 v35.56,12.7 | v39.37,15.24 39.37,15.63 LED3.C | v15.37,10.79 U$2.GND | C9.2 v34.36,28.75 | v31.75,31.75 32.07,31.75 ATMEGA328P-AU.21 | R18.2 FB2.1 | 46.14,56.73 R18.2 | C16.2 v49.53,55.37 | R18.2 46.14,56.3 v46.74,55.37 46.99,55.12 46.99,53.34 | 46.99,53.34 IC4.2 | C18.2 41.91,46.85 v41.91,49.53 | v46.18,53.21 46.99,53.34 | FTDI231XS1.16 52.96,24.33 v52.96,25.66 | v54.72,25.55 54.75,26.28 C1.2 | C6.2 v55.88,16.51 | FTDI231XS1.6 53.72,18.97 v53.72,20.57 | J2.GND 53.34,8.16 v53.34,12.7 | v6.35,7.62 4.08,9.89 U$2.GND2 4.08,11.7 5.08,12.7 v7.62,13.97
  Top 0.254: C4.2 32.38,51.02 MPU6050.18 32.42,50.73 32.87,50.73 34.04,49.56 | C3.2 31.26,44.45 C8.2 34.04,47.24 v34.04,49.53 | Q2.2 14.75,46.99 v12.7,46.99 | J9_PIR2.3 19.05,55.88 22.86,55.88 25.41,53.33 | Q1.2 14.37,38.1 v12.7,38.1
  Top 0.381: C12.C 33.02,9.77 LED2.C
  Top 0.406: 5VREG.2 29.39,14.5 V_IN.2 31.62,12.7 C12.C
  Top 0.508: C2.2 25.41,53.33 21.61,49.53 J1.4 18.73,46.67 Q2.2 | V_IN.2 25.96,9.27 C15.C 19.26,9.27 U$2.GND | Q1.2 17.08,37.4 v19.05,38.1 | 5VREG.4 25.96,24.69 v25.4,24.13 | v19.15,20.73 17.8,19.07 U$2.GND4 | 34.04,49.56 v34.04,49.53 | J9_PIR1.3 12.7,39.37 v12.7,38.1
  Bottom 0.203: v24.18,39.57 24.18,38.43 v27.94,34.67 28.3,34.67 v29.05,35.92
  Bottom 0.229: v35.56,12.7 36.83,12.7 v39.37,15.24 | IC3.10 v15.37,10.79 | v34.36,28.75 34.36,29.14 v31.75,31.75 | v46.74,55.37 v49.53,55.37 | v41.91,49.53 45.72,53.09 v46.18,53.21 | v19.05,38.1 22.71,38.1 v24.18,39.57 | v52.96,25.66 53.07,25.55 v54.72,25.55 54.72,20.32 | 54.72,20.32 54.72,17.67 v55.88,16.51 55.88,15.24 v53.34,12.7 | 54.72,20.32 54.46,20.57 v53.72,20.57 | IC3.1 7.41,7.62 v6.35,7.62 6.35,8.89 7.23,9.77 7.23,9.82 7.57,10.16 IC3.4 | IC3.7 8,12.32 v7.62,13.97
  Bottom 0.254: v12.7,46.99 11.43,45.72 J9_PIR1.3 | J2PHOTO_B.1 39.7,27.94 37.57,27.94 36.76,28.75 v34.36,28.75 | v12.7,38.1 11.43,36.83 J9_PIR3.3
  Bottom 0.508: v19.15,20.73 19.15,20.22 20.32,19.05 21.59,19.05 25.4,22.86 v25.4,24.13 | J7_MIC_B.2 46.74,61.04 v46.74,55.37
  pour Bottom (isolate 0.305): 1.27,1.27 1.27,66.04 60.96,66.04 60.96,1.27
  pour Top (isolate 0.381): 1.27,1.27 60.96,1.27 60.96,66.04 1.27,66.04
IR_LED
  Top 0.229: R15.1 16.66,35.56 Q1.1
LED4
  Top 0.229: R26.1 53.05,30.66 LED4.A
LED5
  Top 0.508: R27.1 56,33.37 LED5.A
MIC_IN+
  Top 0.229: C14.2 48.26,60.96 47.84,60.54 R19.2 R18.1 47.84,51.95 IC4.1
MIC_IN_C14
  Top 0.229: R16.2 51.65,60.93 51.65,60.96 C14.1
  Top 0.508: 51.65,60.93 51.63,60.93 50.69,61.87 48.8,61.87 J7_MIC_B.1
MICNET1K
  Top 0.229: C16.1 51.67,56.93 R16.1 50.8,55.92 R20.2
MISO  (via drill 0.51)
  Top 0.203: ATMEGA328P-AU.16 29.06,28.17 28.19,27.3 26.04,27.3 22.86,24.13 22.86,22.86 J1.15
  Top 0.229: U$2.DAT0 14.33,18.14 v19.18,22.86
  Top 0.508: U$2.DAT0 14.09,16.69 14.09,17.39 11.85,19.63 R14.2
  Bottom 0.229: v19.18,22.86 J1.15
MOSI  (via drill 0.51)
  Top 0.203: ATMEGA328P-AU.15 27.73,27.94 25.4,27.94 J1.14
  Top 0.229: v14.48,13.84 14.61,13.84 16.27,14.37 17.81,16.14 20.33,19.43 20.33,22.11 21.59,23.37 J1.14
  Bottom 0.229: IC3.5 8.15,10.97 8.58,10.97 9.21,11.6 9.21,13.3 9.88,13.97 v14.48,13.84
N$1
  Top 0.229: R24.2 R23.2 R13.2 R22.2
  Top 0.508: J5_IR_LED_B.2 6.17,36.83 R22.2
N$2
  Top 0.229: R22.1 R13.1 R23.1 R24.1
  Top 0.254: R22.1 8.85,36.45 Q1.3
N$4
  Top 0.203: R29.1 38.52,16.54 LED3.A
N$6
  Top 0.229: ATMEGA328P-AU.20 33.15,29.86 33.6,29.42 33.86,29.42 34.11,29.67 C9.1
N$12
  Top 0.229: U$3.1 44.18,51.87 R17.1
N$20
  Top 0.508: Q2.1 16.61,44.77 R11.1
N$22
  Top 0.406: D5.1 26.21,12.7 V_IN.1
N$29
  Top 0.229: R21.1 C18.1
N$30
  Top 0.229: 45.93,52.16 IC4.3 | 45.93,52.16 45.47,51.69 45.47,48.77 46.99,47.24 R21.2 48.74,46.57 C17.1 | R17.2 45.59,52.16 45.93,52.16
PB6
  Top 0.203: ATMEGA328P-AU.7 25.68,35.09 25.25,35.52 25.25,35.9 26.68,37.33 26.68,37.89 26.67,37.9 26.67,38.17 26.07,38.77 26.07,39.08 OSC.1
PB7
  Top 0.203: ATMEGA328P-AU.8 25.12,34.49 24.68,34.94 24.68,36.53 24.25,36.95 OSC.3
POWERLED
  Top 0.381: LED2.A 34.71,8.89 R28.1
RESET  (via drill 0.51)
  Top 0.203: C7.2 42.71,39.04 R6.2
  Top 0.254: ATMEGA328P-AU.29 34.29,37.91 v34.29,38.1 | v43.81,38.79 42.76,38.88 C7.2
  Bottom 0.254: v34.29,38.1 43.56,38.1 43.99,38.79 v43.81,38.79
RX  (via drill 0.6)
  Top 0.203: FTDI231XS1.4 52.39,20 v52.32,20.45 | v48.06,20.12 46.72,20.12 R9.1
  Bottom 0.203: v52.32,20.45 48.26,20.32 v48.06,20.12
RXLED  (via drill 0.51)
  Top 0.229: LED4.C 55.74,26.68 v55.5,26.67 | FTDI231XS1.17 52.26,25.16 51.24,25.93 v51.24,26.7 51.25,26.68 51.31,26.68
  Bottom 0.229: 53.34,26.67 v55.5,26.67 | 53.34,26.67 52.48,26.67 | v51.24,26.7 53.31,26.7 53.34,26.67
SCK  (via drill 0.51)  (1 unrouted)
  Top 0.203: 31.45,28.17 32.08,27.53 32.66,27.03 J8.1 38.1,21.17 R29.2
  Top 0.229: v12.69,10.16 13.57,10.16 15.47,12.07 18.42,12.07 20.32,13.97 20.32,15.24 26.67,21.59 J8.1
  Bottom 0.229: IC3.2 10.13,8.86 11.43,10.16 v12.69,10.16
SCK_BUFF  (via drill 0.51)
  Top 0.229: U$2.CLK 11.94,16.26 v11.94,11.81
  Bottom 0.229: v11.94,11.81 9.64,9.51 IC3.3
SCL  (via drill 0.51)
  Top 0.254: ATMEGA328P-AU.28 36.83,39.3 36.83,41.91 J8.9 | MPU6050.23 29.73,53.24 R2.2 30.31,53.76 v30.99,53.09
  Bottom 0.254: v30.99,53.09 30.99,46.48 35.56,41.91 J8.9
SDA  (via drill 0.51)
  Top 0.254: ATMEGA328P-AU.27 34.03,35.3 J8.8 | MPU6050.24 27.56,53.1 R1.2 27.56,50.84 v27.52,50.8
  Bottom 0.254: J8.8 37.99,39.48 35.45,39.48 27.52,47.41 v27.52,50.8
SS  (via drill 0.51)
  Top 0.203: ATMEGA328P-AU.14 27.91,29.3 27.05,28.45 23.37,28.45 J1.13
  Top 0.229: v24.08,22.91 24.13,22.86 24.13,20.32 16.51,12.7 15.24,12.7 15.25,12.71 v15.25,12.89
  Bottom 0.229: J1.13 24.08,24.18 v24.08,22.91 | v15.25,12.89 14.61,12.26 14.61,11.8 14.43,11.62 14,11.62 IC3.9
SS_BUFF  (via drill 0.51)
  Top 0.229: v10.03,12.95 9.93,13.11 U$2.CMD
  Bottom 0.229: IC3.8 13.13,12.83 v10.03,12.95
TX  (via drill 0.6)
  Top 0.203: R8.1 45.97,25.15 v46.99,24.13 | v50.42,22.73 50.42,24.21 FTDI231XS1.20
  Bottom 0.203: v46.99,24.13 49.02,24.13 v50.42,22.73
TX-O_N  (via drill 0.51)
  Top 0.203: ATMEGA328P-AU.30 33.29,38.03 33.29,38.34 34.12,39.17 35.77,39.8 v35.8,40.31 | v41.3,40.66 40.89,39.88 40.89,32.89 44.65,28.96 44.78,28.57 R8.2
  Bottom 0.203: v35.8,40.31 36.02,40.66 v41.3,40.66
TX-O_P  (via drill 0.51)
  Top 0.203: ATMEGA328P-AU.31 32.74,38.62 33,38.62 33.95,39.57 35.35,41.22 v36.07,43.05 | v40.24,43.16 40.24,33.21 40.31,32.77 44.05,28.83 | 44.05,28.83 44.25,28.63 44.25,28.57 | 44.05,28.83 44.25,28.64 44.25,28.41 44.96,27.7 44.96,23.88 46.1,22.73 R9.2
  Bottom 0.203: v36.07,43.05 36.18,43.16 v40.24,43.16
TXLED  (via drill 0.51, 0.6)
  Top 0.203: FTDI231XS1.10 56.2,19.77 v55.73,20.24
  Top 0.508: LED5.C 54.61,32.12 v54.61,33.02
  Bottom 0.203: v55.73,20.24 55.96,20.24 v57.4,22.61
  Bottom 0.508: v54.61,33.02 57.4,30.23 v57.4,22.61
USBD_N
  Top 0.203: FTDI231XS1.12 55.56,21.62 56.95,20.24 56.95,18.59 56.64,18.03 49.5,18.03 49.33,17.11 R7.2
USBD_P
  Top 0.203: FTDI231XS1.11 56.2,21.56 57.35,20.4 57.48,18.04 56.81,17.63 52.33,17.63 52.07,17.49 R5.2
VIN
  Top 0.406: C15.A 22.27,12.11 D5.3 25.17,15.49 5VREG.1
VUSB  (via drill 0.51)  (1 unrouted)
  Top 0.203: FB3.1 49.6,11.02 50.65,10.77 50.77,8.87 J2.VCC | FB3.2 46.82,13.42 C11.A 44.21,14.75 C5.1
  Top 0.229: FTDI231XS1.15 53.53,24.14 53.53,23.57 53.34,23.38 v53.34,22.86 | v45.91,19.3 45.72,19.11 45.21,18.54 45.09,18.29 C5.1
  Bottom 0.229: v53.34,22.86 51.94,21.34 47.24,21.34 45.97,19.88 v45.91,19.3